# Altium schematic sheet fastADCs.SchDoc
size A; SheetNumber: 4; SheetTotal: 24
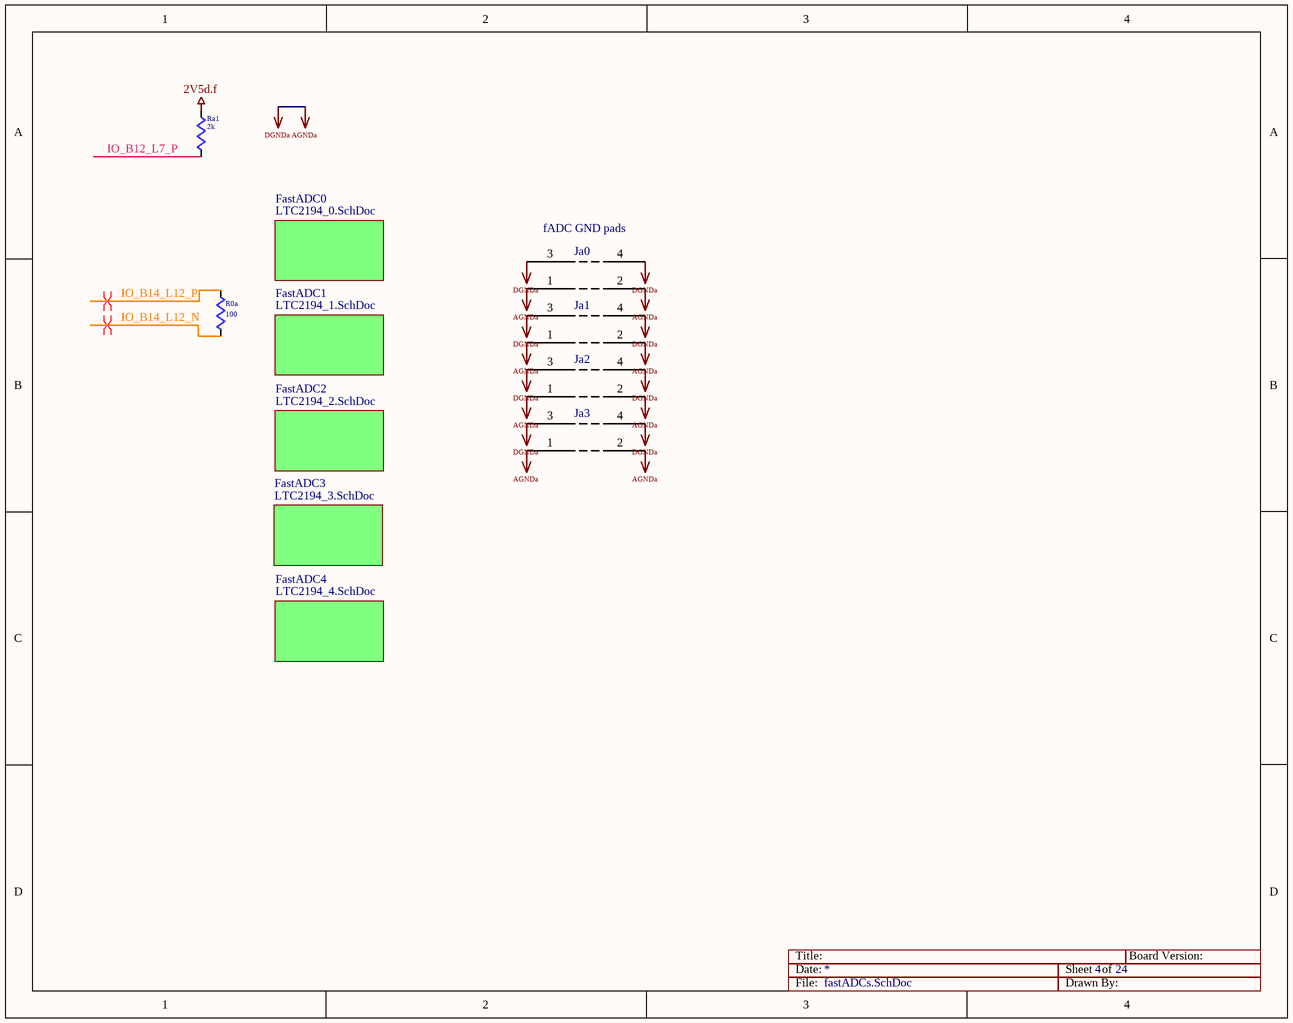
[diagram p0: fastADCs.SchDoc]

## Parts
Ja0  fADC GND pads  [FADC_GND_CONN]
Ja1  fADC GND pads  [FADC_GND_CONN]  (value not drawn)
Ja2  fADC GND pads  [FADC_GND_CONN]  (value not drawn)
Ja3  fADC GND pads  [FADC_GND_CONN]  (value not drawn)
R0a  100  [0402]
Ra1  2k  [0603]

## Sub-sheets
FastADC0 = LTC2194_0.SchDoc: no entries
FastADC1 = LTC2194_1.SchDoc: no entries
FastADC2 = LTC2194_2.SchDoc: no entries
FastADC3 = LTC2194_3.SchDoc: no entries
FastADC4 = LTC2194_4.SchDoc: no entries

## Nets
2V5d.f: Ra1.1
AGNDa: Ja0.1 Ja0.2 Ja0.3 Ja0.4 Ja1.1 Ja1.2 Ja1.3 Ja1.4 Ja2.1 Ja2.2 Ja2.3 Ja2.4 Ja3.1 Ja3.2 Ja3.3 Ja3.4  [also labelled DGNDa]
IO_B12_L7_P: Ra1.2
IO_B14_L12_N: R0a.2
IO_B14_L12_P: R0a.1

## Layout directives
differential pair: IO_B14_L12_N, IO_B14_L12_P

## Notes on the sheet
- Title:
- Date:
- Sheet
- of
- Board Version:
- File:
- Drawn By:

## Library data of the parts
R0a Ra1 = RES